# Altium schematic sheet ShiftRegister.SchDoc
size A4; SheetNumber: 10; SheetTotal: 10
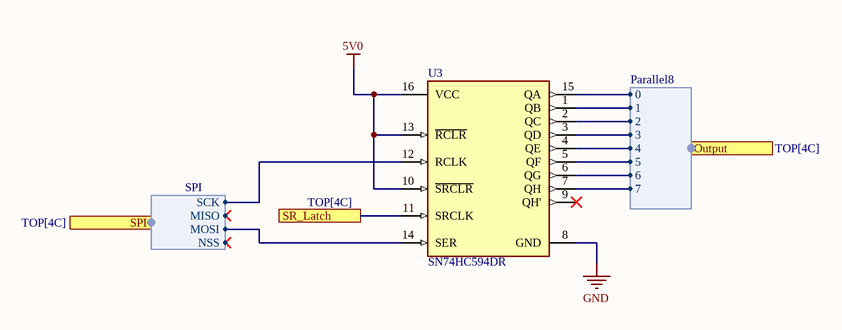
[diagram p0: ShiftRegister.SchDoc]

## Parts
U3  SN74HC594DR  [FP-D0016A-IPC_A]

## Ports
Output (harness Parallel8, see TOP[4C]), SPI (harness SPI, see TOP[4C]), SR_Latch (see TOP[4C])

## Harnesses
SPI: NSS, SCK, MISO, MOSI
Parallel8: 0, 1, 2, 3, 4, 5, 6, 7

## Nets
5V0: U3.10(~{SRCLR}) U3.13(~{RCLR}) U3.16(VCC)
GND: U3.8(GND)
SR_Latch: U3.11(SRCLK) ; port SR_Latch
NetU3_1: U3.1(QB) ; port Output.1
NetU3_2: U3.2(QC) ; port Output.2
NetU3_3: U3.3(QD) ; port Output.3
NetU3_4: U3.4(QE) ; port Output.4
NetU3_5: U3.5(QF) ; port Output.5
NetU3_6: U3.6(QG) ; port Output.6
NetU3_7: U3.7(QH) ; port Output.7
NetU3_12: U3.12(RCLK) ; port SPI.SCK
NetU3_14: U3.14(SER) ; port SPI.MOSI
NetU3_15: U3.15(QA) ; port Output.0

Not connected (* = marked no-connect by the designer): U3 9(QH')*

## Library data of the parts
U3 = CMP-0780-00061-4: IC SHIFT REGISTER 8BIT 16-SOIC; Number of Bits per Element: 8; Min Supply Voltage: 2V; Frequency: 40MHz; Max Supply Voltage: 6V; Operating Supply Voltage: 5V; Number of Output Lines: 10; Propagation Delay: 25ns; Number of Elements: 1; Number of Circuits: 4; Direction: Unidirectional; Turn-On Delay Time: 185ns; RoHS Compliant: Yes; Width: 3.91mm; Length: 9.9mm; Min Operating Temperature: -40°C; Max Operating Temperature: 125°C; Package Quantity: 2500; Series: 74HC; Height: 1.58mm; Number of Bits: 8; Mount: Surface Mount; Logic Function: Shift Register; Radiation Hardening: No; Number of Pins: 16; Technology: CMOS; Packaging: Tape and Reel; Lead Free: Lead Free; Weight: 0.004998oz; REACH SVHC: No SVHC; Case/Package: SOIC